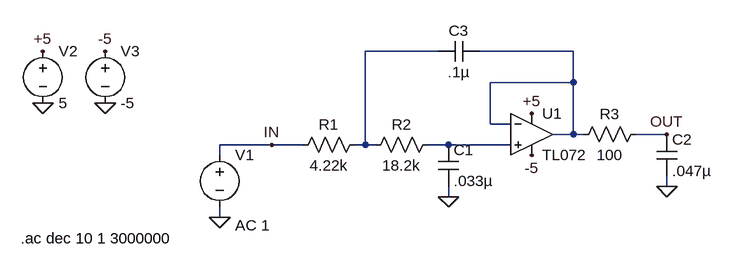
[diagram p0: schematic sallen key low pass.asc]
sallen key low pass.asc, the LTspice schematic file:
Version 4
SHEET 1 880 680
WIRE 224 -48 112 -48
WIRE 432 -48 288 -48
WIRE 432 0 432 -48
WIRE 432 0 304 0
WIRE 304 64 304 0
WIRE 336 64 304 64
WIRE 432 80 432 0
WIRE 432 80 400 80
WIRE 448 80 432 80
WIRE 576 80 528 80
WIRE -32 96 -112 96
WIRE 16 96 -32 96
WIRE 112 96 112 -48
WIRE 112 96 96 96
WIRE 128 96 112 96
WIRE 240 96 208 96
WIRE 336 96 240 96
WIRE -112 112 -112 96
WIRE 576 160 576 144
WIRE 240 176 240 160
WIRE -112 208 -112 192
FLAG -112 208 0
FLAG 240 176 0
FLAG 576 160 0
FLAG 368 48 +5
FLAG -384 -48 +5
FLAG -384 32 0
FLAG -288 32 0
FLAG -288 -48 -5
FLAG 368 112 -5
FLAG 576 80 OUT
FLAG -32 96 IN
SYMBOL voltage -112 96 R0
WINDOW 123 24 124 Left 2
WINDOW 39 0 0 Left 0
SYMATTR InstName V1
SYMATTR Value ""
SYMATTR Value2 AC 1
SYMBOL res 112 80 R90
WINDOW 0 0 56 VBottom 2
WINDOW 3 32 56 VTop 2
SYMATTR InstName R1
SYMATTR Value 4.22k
SYMBOL res 224 80 R90
WINDOW 0 0 56 VBottom 2
WINDOW 3 32 56 VTop 2
SYMATTR InstName R2
SYMATTR Value 18.2k
SYMBOL cap 224 96 R0
SYMATTR InstName C1
SYMATTR Value .033µ
SYMBOL ZZZ\\OpAmp\\TL072 368 80 R0
SYMATTR InstName U1
SYMBOL res 544 64 R90
WINDOW 0 0 56 VBottom 2
WINDOW 3 32 56 VTop 2
SYMATTR InstName R3
SYMATTR Value 100
SYMBOL cap 560 80 R0
SYMATTR InstName C2
SYMATTR Value .047µ
SYMBOL cap 288 -64 R90
WINDOW 0 0 32 VBottom 2
WINDOW 3 32 32 VTop 2
SYMATTR InstName C3
SYMATTR Value .1µ
SYMBOL voltage -384 -64 R0
WINDOW 123 0 0 Left 0
WINDOW 39 0 0 Left 0
SYMATTR InstName V2
SYMATTR Value 5
SYMBOL voltage -288 -64 R0
WINDOW 123 0 0 Left 0
WINDOW 39 0 0 Left 0
SYMATTR InstName V3
SYMATTR Value -5
TEXT -418 240 Left 2 !.ac dec 10 1 3000000

The netlist it stands for:
* sallen key low pass.asc
V1 IN 0 AC 1
R1 N001 IN 4.22k
R2 N003 N001 18.2k
C1 N003 0 .033µ
* U1: TL072 (symbol ZZZ\OpAmp\TL072 not available, pins judged from their places): In+=N003 In-=N002 V+=+5 V-=-5 OUT=N002
R3 OUT N002 100
C2 OUT 0 .047µ
C3 N002 N001 .1µ
V2 +5 0 5
V3 -5 0 -5
.ac dec 10 1 3000000
.backanno
.end